# EAGLE design connector_PCI (EAGLE 7.6.0)
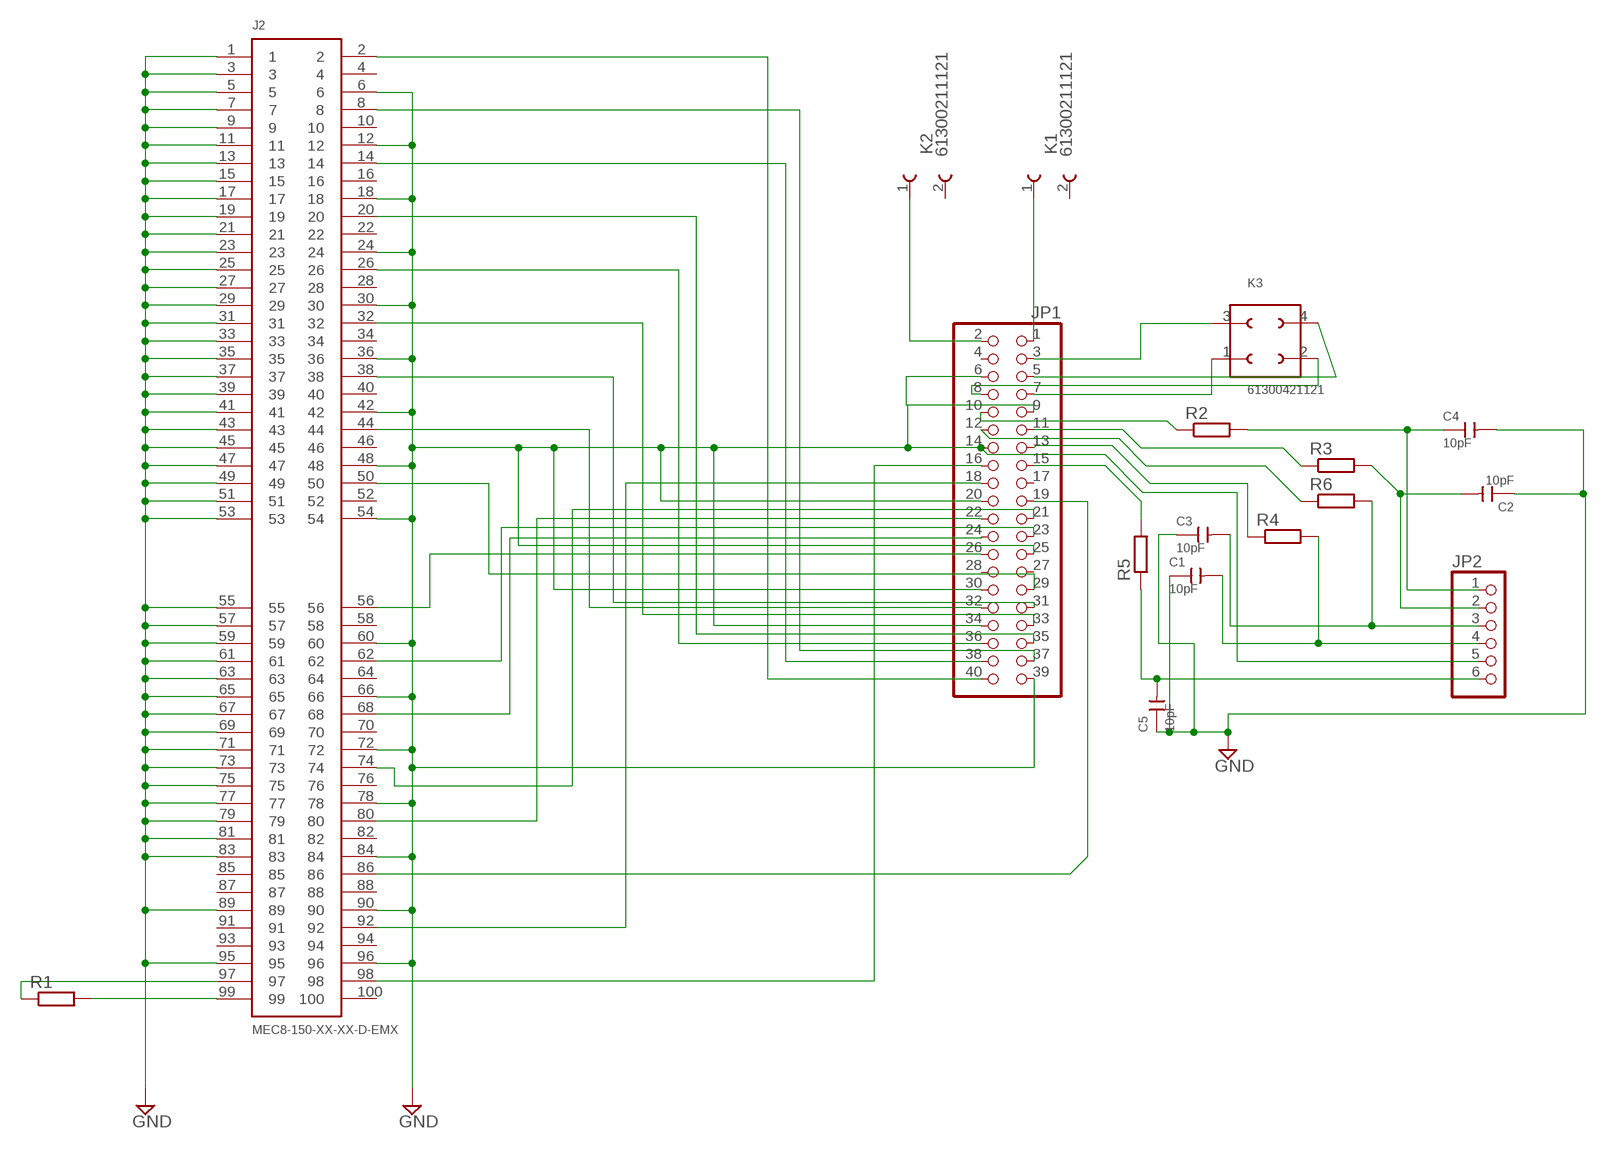
[diagram p0: schematic, sheet 1]

## Parts
C1  10pF  CERAMIC-470NF-25V-10%-X7R(0603)  [C0603]
C2  10pF  CERAMIC-470NF-25V-10%-X7R(0603)  [C0603]
C3  10pF  CERAMIC-470NF-25V-10%-X7R(0603)  [C0603]
C4  10pF  CERAMIC-470NF-25V-10%-X7R(0603)  [C0603]
C5  10pF  CERAMIC-470NF-25V-10%-X7R(0603)  [C0603]
J2  MEC8-150-XX-XX-D-EMX  [MEC8-150-XX-XX-D-EMX]
JP1  PINHD-2X20_2.54  [2X20]
JP2  PINHD-1X06_2.54  [1X06]
K1  61300211121  [61300211121]
K2  61300211121  [61300211121]
K3  61300421121  [61300421121]
R1  R-EU_R0402  [R0402]
R2  R-EU_R0402  [R0402]
R3  R-EU_R0402  [R0402]
R4  R-EU_R0402  [R0402]
R5  R-EU_R0402  [R0402]
R6  R-EU_R0402  [R0402]

## Nets
GND: C1.1 C2.1 C3.1 C4.2 C5.1 J2.1 J2.3 J2.5 J2.6 J2.7 J2.9 J2.11 J2.12 J2.13 J2.15 J2.17 J2.18 J2.19 J2.21 J2.23 J2.24 J2.25 J2.27 J2.29 J2.30 J2.31 J2.33 J2.35 J2.36 J2.37 J2.39 J2.41 J2.42 J2.43 J2.45 J2.47 J2.48 J2.49 J2.51 J2.53 J2.54 J2.55 J2.57 J2.59 J2.60 J2.61 J2.63 J2.65 J2.66 J2.67 J2.69 J2.71 J2.72 J2.73 J2.75 J2.77 J2.78 J2.79 J2.81 J2.83 J2.84 J2.89 J2.90 J2.95 J2.96 JP1.6 JP1.9 JP1.14 JP1.20 JP1.25 JP1.30 JP1.34 JP1.39 JP2.5
N$1: J2.2 JP1.40
N$2: J2.50 JP1.29
N$3: J2.8 JP1.37
N$4: C4.1 JP2.1 R2.2
N$5: J2.14 JP1.38
N$6: J2.20 JP1.35
N$7: J2.26 JP1.36
N$8: J2.32 JP1.33
N$9: J2.38 JP1.31
N$10: JP1.1 K1.1
N$11: JP1.2 K2.1
N$12: J2.44 JP1.32
N$13: J2.62 JP1.23
N$14: JP1.8 K3.2
N$15: JP1.5 K3.4
N$16: J2.56 JP1.26
N$17: JP1.7 K3.1
N$18: J2.97 R1.1
N$19: J2.99 R1.2
N$20: JP1.3 K3.3
N$21: JP1.10 R2.1
N$22: J2.68 JP1.24
N$23: J2.98 JP1.16
N$24: C3.2 JP2.3 R6.2
N$25: C1.2 JP2.4 R4.2
N$26: J2.74 JP1.21
N$27: C5.2 JP2.6 R5.1
N$28: J2.80 JP1.22
N$29: J2.86 JP1.19
N$31: J2.92 JP1.18
N$32: JP1.11 R3.1
N$33: JP1.13 R4.1
N$34: JP1.15 R5.2
N$35: JP1.12 R6.1
N$36: C2.2 JP2.2 R3.2
Unconnected: J2.4 J2.10 J2.16 J2.22 J2.28 J2.34 J2.40 J2.46 J2.52 J2.58 J2.64 J2.70 J2.76 J2.82 J2.85 J2.87 J2.88 J2.91 J2.93 J2.94 J2.100 JP1.4 JP1.17 JP1.27 JP1.28 K1.2 K2.2

## Library data of the parts
C1-C5 = Bestandteile:CERAMIC-470NF-25V-10%-X7R(0603): 302010092; MPN: CC0603KRX7R8BB474; VALUE: 470nf
J2 = 0_MEC8-150-XX-XX-D-EMX:MEC8-150-XX-XX-D-EMX: 0.8MM DUAL EDGE MOUNT MINI-EDGE CARD ASSEMBLY.
JP1 = pinhead-2:PINHD-2X20: PIN HEADER
JP2 = pinhead-2:PINHD-1X06: PIN HEADER
K1 K2 = Bestandteile:61300211121: WR-PHD 2.54mm Pin Header, 2 Pin=>Code : Con_BTB_PHD_2.54_1_THT_61300211121 <http://katalog.we-online.de/media/images/eican/Con_BTB_PHD_2.54_1_THT_6130xx11121_pf2.jpg> Details see: http://katalog.we-online.de/en/em/613_0xx_111_21 Created 2014-05-29, Karrer Zheng 2014 (C) Würth Elektronik
K3 = Bestandteile:61300421121: WR-PHD 2.54mm Dual Pin Header, 4 Pins =>Code : Con_BTB_PHD_2.54_2_61300421121 <http://katalog.we-online.de/media/images/eican/Con_BTB_PHD_2.54_2_6130xx21121_pf2.jpg> Details see: http://katalog.we-online.de/en/em/613_0xx_211_21 Created 2014-05-29, Karrer Zheng 2014 (C) Würth Elektronik
R1-R6 = rcl:R-EU_: RESISTOR, European symbol

## Board
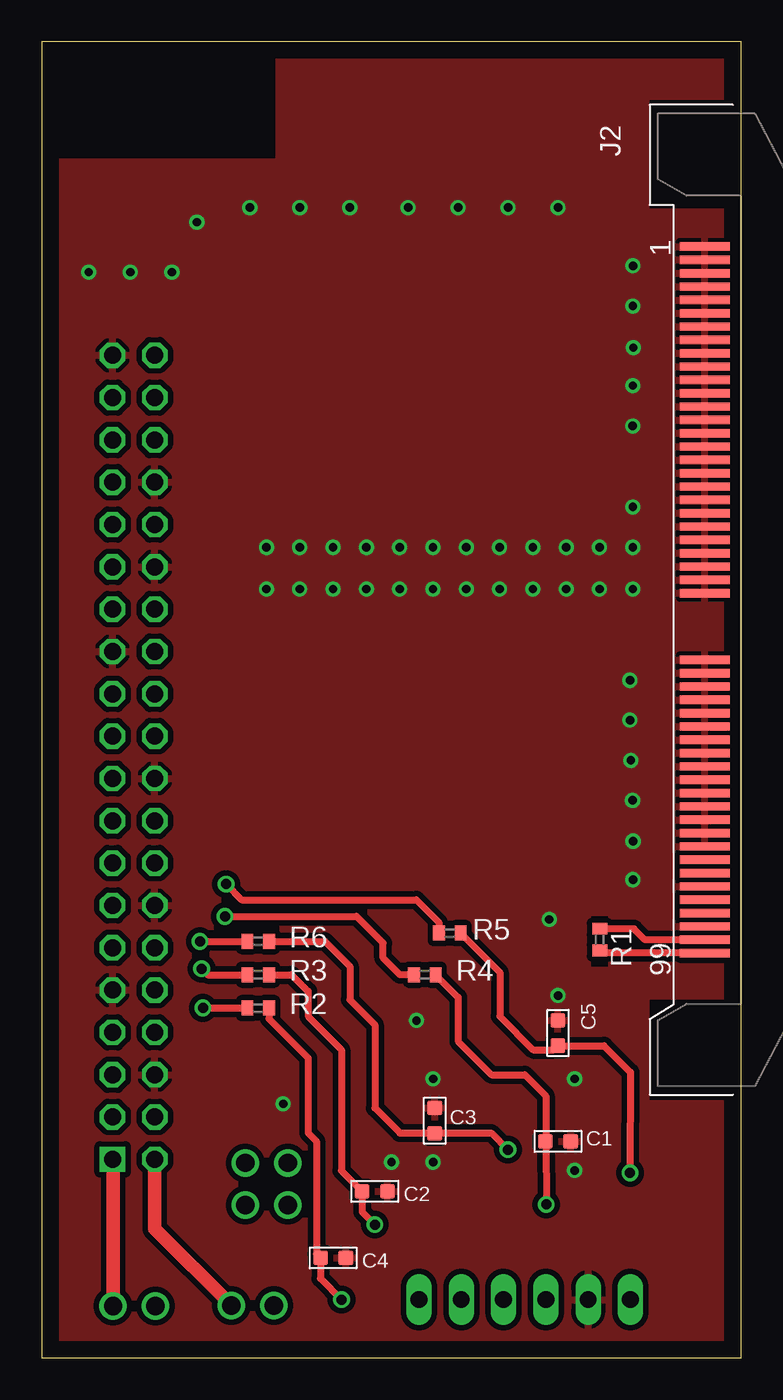
[diagram p1: board, top side]
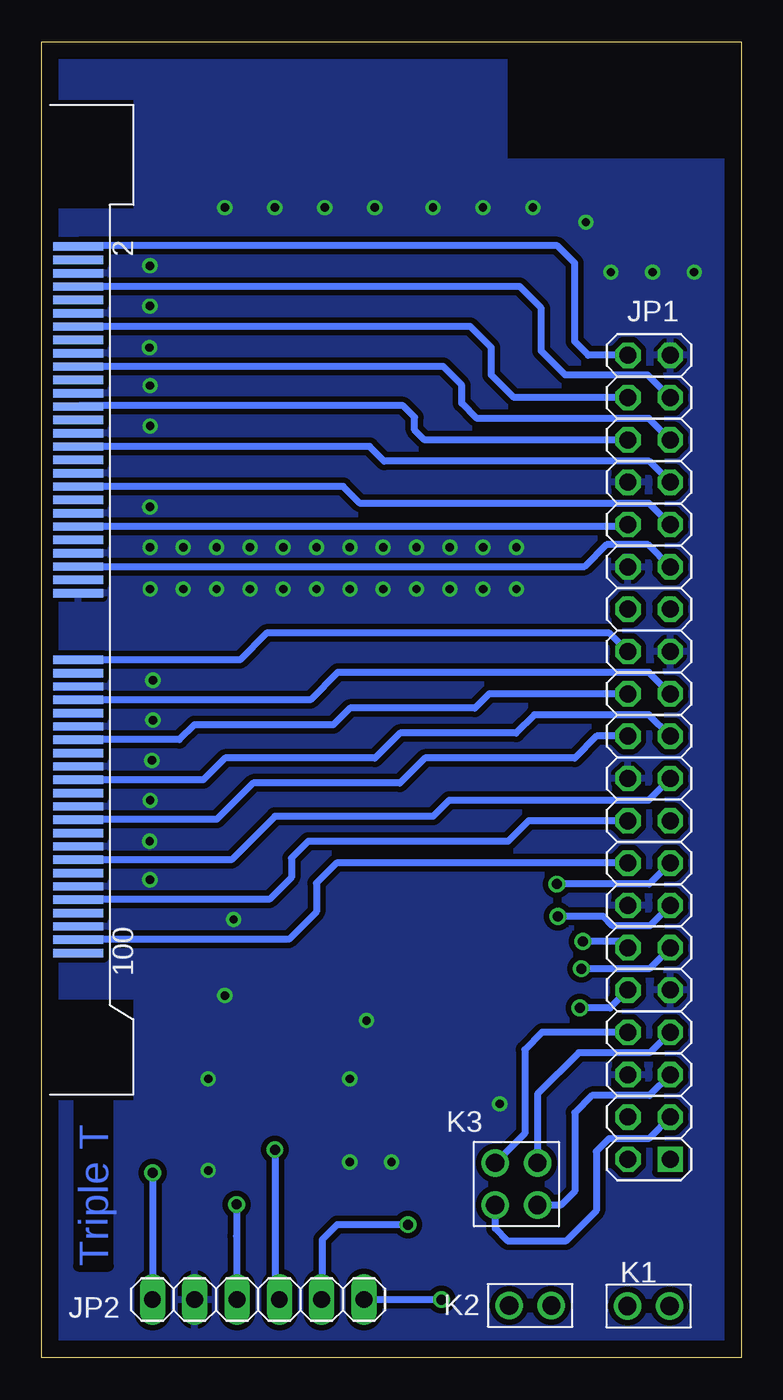
[diagram p2: board, bottom side, seen from below]

Size 42 x 79 mm. Coordinates in mm from the lower left corner, seen from the top.
Outline: 0,0 42,0 42,79 0,79 0,0
Copper layers (1*16): Top 0.035mm / dielectric 1.5mm / Bottom 0.035mm
Design rules "default *": minimum track width 10mil, minimum drill 24mil, track to track 13mil, track to pad 8mil, pad to pad 8mil, via to via 8mil, smd to smd 8mil, copper to edge 40mil, drill to drill 8mil, minimum pad ring 10mil, minimum via ring 8mil, stop-mask expansion 4mil, vias tented up to drill 0mil, thermal gap 10mil
tRestrict: area 33,23.5 to 34,26.5; area 1,72 to 14,78; area 36.5,15.5 to 41,21.5; area 36.5,69 to 41,75.5
bRestrict: area 1,72 to 14,78; area 36.5,15.5 to 41,21.5; area 36.5,69 to 41,75.5

### Footprints (pad centres in the part's own frame; a part is rotated, then mirrored left to right if it is on the bottom)
C0603 = smd 0.889 x 0.889: 1 0,0.762; 2 0,-0.762
MEC8-150-XX-XX-D-EMX = smd 0.5 x 3: 1 -21.2,-2.2; 3 -20.4,-2.2; 5 -19.6,-2.2; 7 -18.8,-2.2; 9 -18,-2.2; 11 -17.2,-2.2; 13 -16.4,-2.2; 15 -15.6,-2.2; 17 -14.8,-2.2; 19 -14,-2.2; 21 -13.2,-2.2; 23 -12.4,-2.2; 25 -11.6,-2.2; 27 -10.8,-2.2; 29 -10,-2.2; 31 -9.2,-2.2; 33 -8.4,-2.2; 35 -7.6,-2.2; 37 -6.8,-2.2; 39 -6,-2.2; 41 -5.2,-2.2; 43 -4.4,-2.2; 45 -3.6,-2.2; 47 -2.8,-2.2; 49 -2,-2.2; 51 -1.2,-2.2; 53 -0.4,-2.2; 55 3.6,-2.2; 57 4.4,-2.2; 59 5.2,-2.2; 61 6,-2.2; 63 6.8,-2.2; 65 7.6,-2.2; 67 8.4,-2.2; 69 9.2,-2.2; 71 10,-2.2; 73 10.8,-2.2; 75 11.6,-2.2; 77 12.4,-2.2; 79 13.2,-2.2; 81 14,-2.2; 83 14.8,-2.2; 85 15.6,-2.2; 87 16.4,-2.2; 89 17.2,-2.2; 91 18,-2.2; 93 18.8,-2.2; 95 19.6,-2.2; 97 20.4,-2.2; 99 21.2,-2.2 | smd 0.5 x 3 bottom: 2 -21.2,-2.2; 4 -20.4,-2.2; 6 -19.6,-2.2; 8 -18.8,-2.2; 10 -18,-2.2; 12 -17.2,-2.2; 14 -16.4,-2.2; 16 -15.6,-2.2; 18 -14.8,-2.2; 20 -14,-2.2; 22 -13.2,-2.2; 24 -12.4,-2.2; 26 -11.6,-2.2; 28 -10.8,-2.2; 30 -10,-2.2; 32 -9.2,-2.2; 34 -8.4,-2.2; 36 -7.6,-2.2; 38 -6.8,-2.2; 40 -6,-2.2; 42 -5.2,-2.2; 44 -4.4,-2.2; 46 -3.6,-2.2; 48 -2.8,-2.2; 50 -2,-2.2; 52 -1.2,-2.2; 54 -0.4,-2.2; 56 3.6,-2.2; 58 4.4,-2.2; 60 5.2,-2.2; 62 6,-2.2; 64 6.8,-2.2; 66 7.6,-2.2; 68 8.4,-2.2; 70 9.2,-2.2; 72 10,-2.2; 74 10.8,-2.2; 76 11.6,-2.2; 78 12.4,-2.2; 80 13.2,-2.2; 82 14,-2.2; 84 14.8,-2.2; 86 15.6,-2.2; 88 16.4,-2.2; 90 17.2,-2.2; 92 18,-2.2; 94 18.8,-2.2; 96 19.6,-2.2; 98 20.4,-2.2; 100 21.2,-2.2
2X20 = drill 1.016 square: 1 -24.13,-1.27 | drill 1.016 octagon: 2 -24.13,1.27; 3 -21.59,-1.27; 4 -21.59,1.27; 5 -19.05,-1.27; 6 -19.05,1.27; 7 -16.51,-1.27; 8 -16.51,1.27; 9 -13.97,-1.27; 10 -13.97,1.27; 11 -11.43,-1.27; 12 -11.43,1.27; 13 -8.89,-1.27; 14 -8.89,1.27; 15 -6.35,-1.27; 16 -6.35,1.27; 17 -3.81,-1.27; 18 -3.81,1.27; 19 -1.27,-1.27; 20 -1.27,1.27; 21 1.27,-1.27; 22 1.27,1.27; 23 3.81,-1.27; 24 3.81,1.27; 25 6.35,-1.27; 26 6.35,1.27; 27 8.89,-1.27; 28 8.89,1.27; 29 11.43,-1.27; 30 11.43,1.27; 31 13.97,-1.27; 32 13.97,1.27; 33 16.51,-1.27; 34 16.51,1.27; 35 19.05,-1.27; 36 19.05,1.27; 37 21.59,-1.27; 38 21.59,1.27; 39 24.13,-1.27; 40 24.13,1.27
1X06 = drill 1.016 long: 1 -6.35,0; 2 -3.81,0; 3 -1.27,0; 4 1.27,0; 5 3.81,0; 6 6.35,0
61300211121 = drill 1.1: 1 -1.27,0; 2 1.27,0
61300421121 = drill 1.1: 1 -1.27,-1.27; 2 1.27,-1.27; 3 1.27,1.27; 4 -1.27,1.27
R0402 = smd 0.7 x 0.9: 1 -0.65,0; 2 0.65,0

### Placement (x,y rotation side)
C1  31,13 270 top
C2  20,10 270 top
C3  23.6,14.23 0 top
C4  17.5,6 90 top
C5  31,19.5 0 top
J2  42,45.5 270 top
JP1  5.53,36.05 90 bottom
JP2  29,3.5 180 bottom
K1  5.56,3.11 180 bottom
K2  12.67,3.15 180 bottom
K3  13.5,10.43 180 bottom
R1  33.51,25.1 270 top
R2  13,21 0 top
R3  13,23 0 top
R4  23,23 0 top
R5  24.5,25.5 180 top
R6  13,25 0 top

### Tracks (layer width: path | path; a pad name or v marks a point on that pad's centre or on a via)
GND  (via drill 0.5)
  other vias: 35.48,33.47 14.5,15.25 30.48,26.31 35.38,35.86 35.5,48.65 35.32,38.28 35.5,51.07 35.5,28.7 35.51,31.01 35.53,60.63 35.5,63.14 35.5,65.55 35.49,58.35 35.49,55.93 22.5,20.25 23.5,16.75 21,11.75 23.5,11.75 32,11.25 32,16.75 31,21.75 35.5,46.15 12.5,69.05 15.5,69.05 18.5,69.05 22,69.05 25,69.05 28,69.05 31,69.05 35.32,40.67 9.32,68.17 7.82,65.17 5.32,65.17 2.82,65.17 33.5,46.15 31.5,46.15 29.5,46.15 27.5,46.15 25.5,46.15 23.5,46.15 21.5,46.15 19.5,46.15 17.5,46.15 15.5,46.15 13.5,46.15 33.5,48.65 31.5,48.65 29.5,48.65 27.5,48.65 25.5,48.65 23.5,48.65 21.5,48.65 19.5,48.65 17.5,48.65 15.5,48.65 13.5,48.65
  pour Top: 0,79 42,79 42,0 0,0
  pour Bottom: 0,79 42,79 42,0 0,0
N$1
  Bottom 0.406: JP1.40 9.18,60.18 10,61 10,65.72 11.03,66.75 39.75,66.75 J2.2
N$2
  Bottom 0.406: J2.50 9.39,47.5 8.08,48.81 5.59,48.81 JP1.29
N$3
  Bottom 0.406: JP1.37 5.61,58.99 10.56,58.99 12,60.44 12,63 13.3,64.3 J2.8
N$4  (via drill 0.6)
  Top 0.406: v18,3.5 16.74,4.76 C4.1 16.5,6.24 16.5,13 16,13.5 16,18 13.65,20.35 R2.2
  Bottom 0.406: v18,3.5 JP2.1
N$5
  Bottom 0.406: JP1.38 13.64,57.64 15,59 15,60.64 16.26,61.9 J2.14
N$6
  Bottom 0.406: JP1.35 5.54,56.38 15.86,56.38 16.77,57.29 16.77,58.38 17.89,59.5 J2.20
N$7
  Bottom 0.406: JP1.36 19.01,55.1 19.61,55.7 19.61,56.45 20.3,57.14 39.76,57.14 J2.26
N$8
  Bottom 0.406: JP1.33 5.53,53.82 21.43,53.82 22.31,54.7 J2.32
N$9
  Bottom 0.406: JP1.31 5.53,51.29 22.88,51.29 23.89,52.3 J2.38
N$10
  Top 0.813: K1.1 4.29,11.88 JP1.1
N$11
  Top 0.813: JP1.2 6.8,7.75 K2.1
N$12
  Bottom 0.406: JP1.32 6.91,49.9 J2.44
N$13
  Bottom 0.406: JP1.23 5.54,41.13 24.22,41.13 25.86,39.49 J2.62
N$14
  Bottom 0.406: JP1.8 11.96,19.54 13,18.5 13,13.47 K3.2
N$15
  Bottom 0.406: JP1.5 5.51,15.75 8.96,15.75 10,14.71 10,10 10.84,9.16 K3.4
N$16
  Bottom 0.406: JP1.26 7.9,43.5 28.5,43.5 30.1,41.9 J2.56
N$17
  Bottom 0.406: JP1.7 5.49,18.31 9.76,18.31 12.23,15.84 K3.1
N$18
  Top 0.406: J2.97 36.23,25.1 35.57,25.76 R1.1
N$19
  Top 0.406: J2.99 33.67,24.3 R1.2
N$20
  Bottom 0.406: JP1.3 5.56,13.16 7.94,13.16 8.71,12.39 8.71,8.83 10.54,7 14,7 14.77,7.77 K3.3
N$21  (via drill 0.6)
  Top 0.406: v9.69,21.01 R2.1
  Bottom 0.406: JP1.10 7.87,21 v9.69,21.01
N$22
  Bottom 0.406: JP1.24 15.14,39.86 16,39 23.5,39 24.5,38 32.84,38 33.73,37.1 J2.68
N$23
  Bottom 0.406: JP1.16 24.3,29.7 25.5,28.5 25.5,26.77 27.15,25.12 39.78,25.12 J2.98
N$24  (via drill 0.6)
  Top 0.406: R6.2 17,25 18.5,23.5 18.5,21.5 20,20 20,15 21.5,13.5 23.57,13.5 | 23.57,13.5 C3.2 | 23.57,13.5 27,13.5 v28,12.5
  Bottom 0.406: v28,12.5 28,3.77 JP2.3
N$25  (via drill 0.6)
  Top 0.406: R4.2 25,21.65 25,19 27,17 29,17 30.27,15.73 30.27,13.03 | 30.27,13.03 C1.2 | 30.27,13.03 v30.29,9.21
  Bottom 0.406: v30.29,9.21 arc-1 JP2.4
N$26
  Bottom 0.406: JP1.21 5.54,38.59 12.42,38.59 13.51,37.5 20.5,37.5 22,36 31,36 32.3,34.7 J2.74
N$27  (via drill 0.6)
  Top 0.406: R5.1 27.5,23.15 27.5,20.5 29.5,18.5 30.76,18.5 C5.2 33.76,18.74 35.35,17.15 v35.33,11.1
  Bottom 0.406: v35.33,11.1 JP2.6
N$28
  Bottom 0.406: JP1.22 8.68,37.32 10,36 19,36 20.5,34.5 29.3,34.5 31.48,32.32 39.78,32.32 J2.80
N$29
  Bottom 0.406: JP1.19 5.57,33.46 17.54,33.46 18.5,32.5 28,32.5 30.6,29.9 J2.86
N$31
  Bottom 0.406: JP1.18 12.76,32.24 14,31 26,31 27,30 27,28.84 28.32,27.52 39.77,27.52 J2.92
N$32  (via drill 0.6)
  Top 0.406: v9.6,23.36 9.96,23 R3.1
  Bottom 0.406: JP1.11 5.52,23.36 v9.6,23.36
N$33  (via drill 0.6)
  Top 0.406: R4.1 21.5,23 20.5,24 20.5,24.9 18.9,26.5 v11,26.5
  Bottom 0.406: JP1.13 5.48,25.93 7.72,25.93 8.29,26.5 v11,26.5
N$34  (via drill 0.6)
  Top 0.406: R5.2 23.85,26.15 22.5,27.5 12,27.5 v11.07,28.43
  Bottom 0.406: JP1.15 5.52,28.43 v11.07,28.43
N$35  (via drill 0.6)
  Top 0.406: v9.5,25 R6.1
  Bottom 0.406: JP1.12 7.18,25 v9.5,25
N$36  (via drill 0.6)
  Top 0.406: R3.2 15,23 16,22 16,20.5 18,18.5 18,11.24 C2.2 19.24,8.76 v20,8
  Bottom 0.406: v20,8 24.25,8 25.16,7.1 25.16,3.53 JP2.2

### Text on the board
Bottom: Triple T